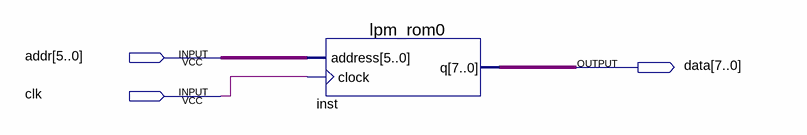
[diagram p0: schematic sheet]
// Quartus schematic lab1.bdf as structural Verilog: 1 symbols, 3 pins
module lab1 (
  input  [5:0] addr,
  input  clk,
  output [7:0] data
);

  lpm_rom0 inst (.address(addr), .clock(clk), .q(data));
endmodule
